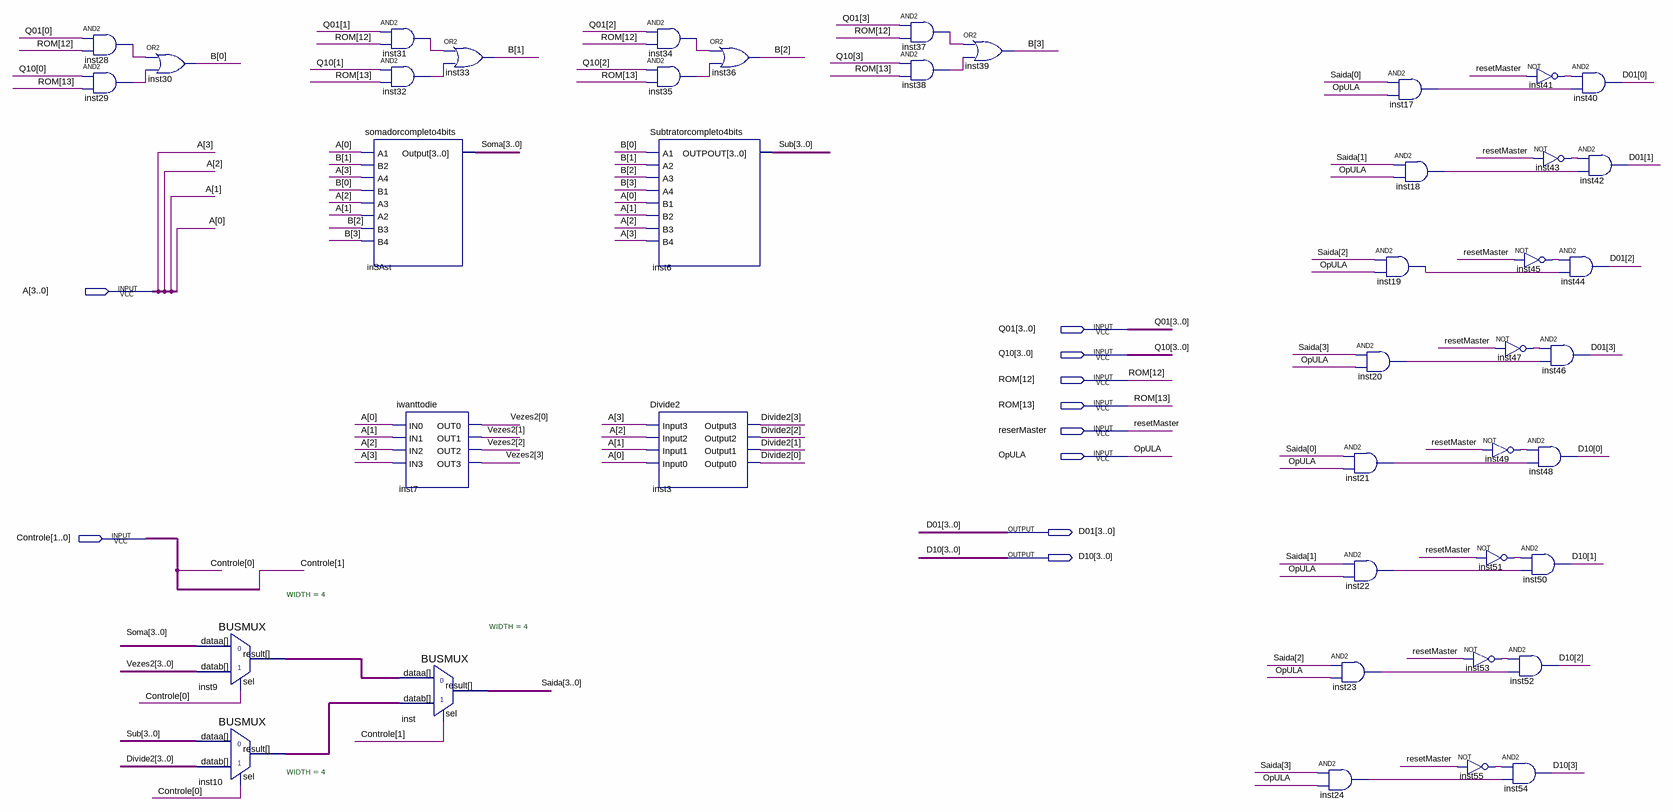
[diagram p0: schematic sheet]
// Quartus schematic ULA.bdf as structural Verilog: 43 symbols, 10 pins
module ULA (
  input  [3:0] A,
  input  [3:0] Q01,
  input  [3:0] Q10,
  input  [13:12] ROM,
  input  reserMaster,
  input  OpULA,
  input  [1:0] Controle,
  output [3:0] D01,
  output [3:0] D10
);

  wire inst17_out, inst18_out, inst19_out, inst20_out, inst21_out, inst22_out, inst23_out, inst24_out,
       inst28_out, inst29_out, inst31_out, inst32_out, inst34_out, inst35_out, inst37_out, inst38_out,
       inst41_out, inst43_out, inst45_out, inst47_out, inst49_out, inst51_out, inst53_out, inst55_out;
  wire [3:0] B, Divide2, inst9_result, inst10_result, Saida, Soma, Sub, Vezes2;

  and inst28 (inst28_out, Q01[0], ROM[12]);
  and inst29 (inst29_out, Q10[0], ROM[13]);
  or inst30 (B[0], inst28_out, inst29_out);
  BUSMUX #(.WIDTH(4)) inst9 (.datab(Vezes2), .sel(Controle[0]), .dataa(Soma), .result(inst9_result));
  BUSMUX #(.WIDTH(4)) inst10 (.datab(Divide2), .sel(Controle[0]), .dataa(Sub), .result(inst10_result));
  somadorcompleto4bits inSAst (
    .A1(A[0]), .B2(B[1]), .A4(A[3]), .B1(B[0]), .A3(A[2]), .A2(A[1]), .B3(B[2]), .B4(B[3]), .Output(Soma));
  and inst31 (inst31_out, Q01[1], ROM[12]);
  and inst32 (inst32_out, Q10[1], ROM[13]);
  iwanttodie inst7 (
    .IN0(A[0]), .IN1(A[1]), .IN2(A[2]), .IN3(A[3]), .OUT0(Vezes2[0]), .OUT1(Vezes2[1]), .OUT2(Vezes2[2]),
    .OUT3(Vezes2[3]));
  BUSMUX #(.WIDTH(4)) inst (.datab(inst10_result), .sel(Controle[1]), .dataa(inst9_result), .result(Saida));
  or inst33 (B[1], inst31_out, inst32_out);
  and inst34 (inst34_out, Q01[2], ROM[12]);
  and inst35 (inst35_out, Q10[2], ROM[13]);
  Subtratorcompleto4bits inst6 (
    .A1(B[0]), .A2(B[1]), .A3(B[2]), .A4(B[3]), .B1(A[0]), .B2(A[1]), .B3(A[2]), .B4(A[3]), .OUTPOUT(Sub));
  Divide2 inst3 (
    .Input3(A[3]), .Input2(A[2]), .Input1(A[1]), .Input0(A[0]), .Output3(Divide2[3]), .Output2(Divide2[2]),
    .Output1(Divide2[1]), .Output0(Divide2[0]));
  or inst36 (B[2], inst34_out, inst35_out);
  and inst37 (inst37_out, Q01[3], ROM[12]);
  and inst38 (inst38_out, Q10[3], ROM[13]);
  or inst39 (B[3], inst37_out, inst38_out);
  and inst23 (inst23_out, Saida[2], OpULA);
  and inst24 (inst24_out, Saida[3], OpULA);
  and inst19 (inst19_out, Saida[2], OpULA);
  and inst20 (inst20_out, Saida[3], OpULA);
  and inst21 (inst21_out, Saida[0], OpULA);
  and inst22 (inst22_out, Saida[1], OpULA);
  and inst17 (inst17_out, Saida[0], OpULA);
  and inst18 (inst18_out, Saida[1], OpULA);
  not inst49 (inst49_out, reserMaster);
  not inst51 (inst51_out, reserMaster);
  not inst53 (inst53_out, reserMaster);
  not inst55 (inst55_out, reserMaster);
  not inst41 (inst41_out, reserMaster);
  not inst43 (inst43_out, reserMaster);
  not inst45 (inst45_out, reserMaster);
  not inst47 (inst47_out, reserMaster);
  and inst48 (D10[0], inst49_out, inst21_out);
  and inst50 (D10[1], inst51_out, inst22_out);
  and inst52 (D10[2], inst53_out, inst23_out);
  and inst54 (D10[3], inst55_out, inst24_out);
  and inst40 (D01[0], inst41_out, inst17_out);
  and inst42 (D01[1], inst43_out, inst18_out);
  and inst44 (D01[2], inst45_out, inst19_out);
  and inst46 (D01[3], inst47_out, inst20_out);

  // Other names for the same wires on the sheet: resetMaster = reserMaster
endmodule
